# EAGLE design BigBus_XXL_Breed_Error (EAGLE 7.7.0)
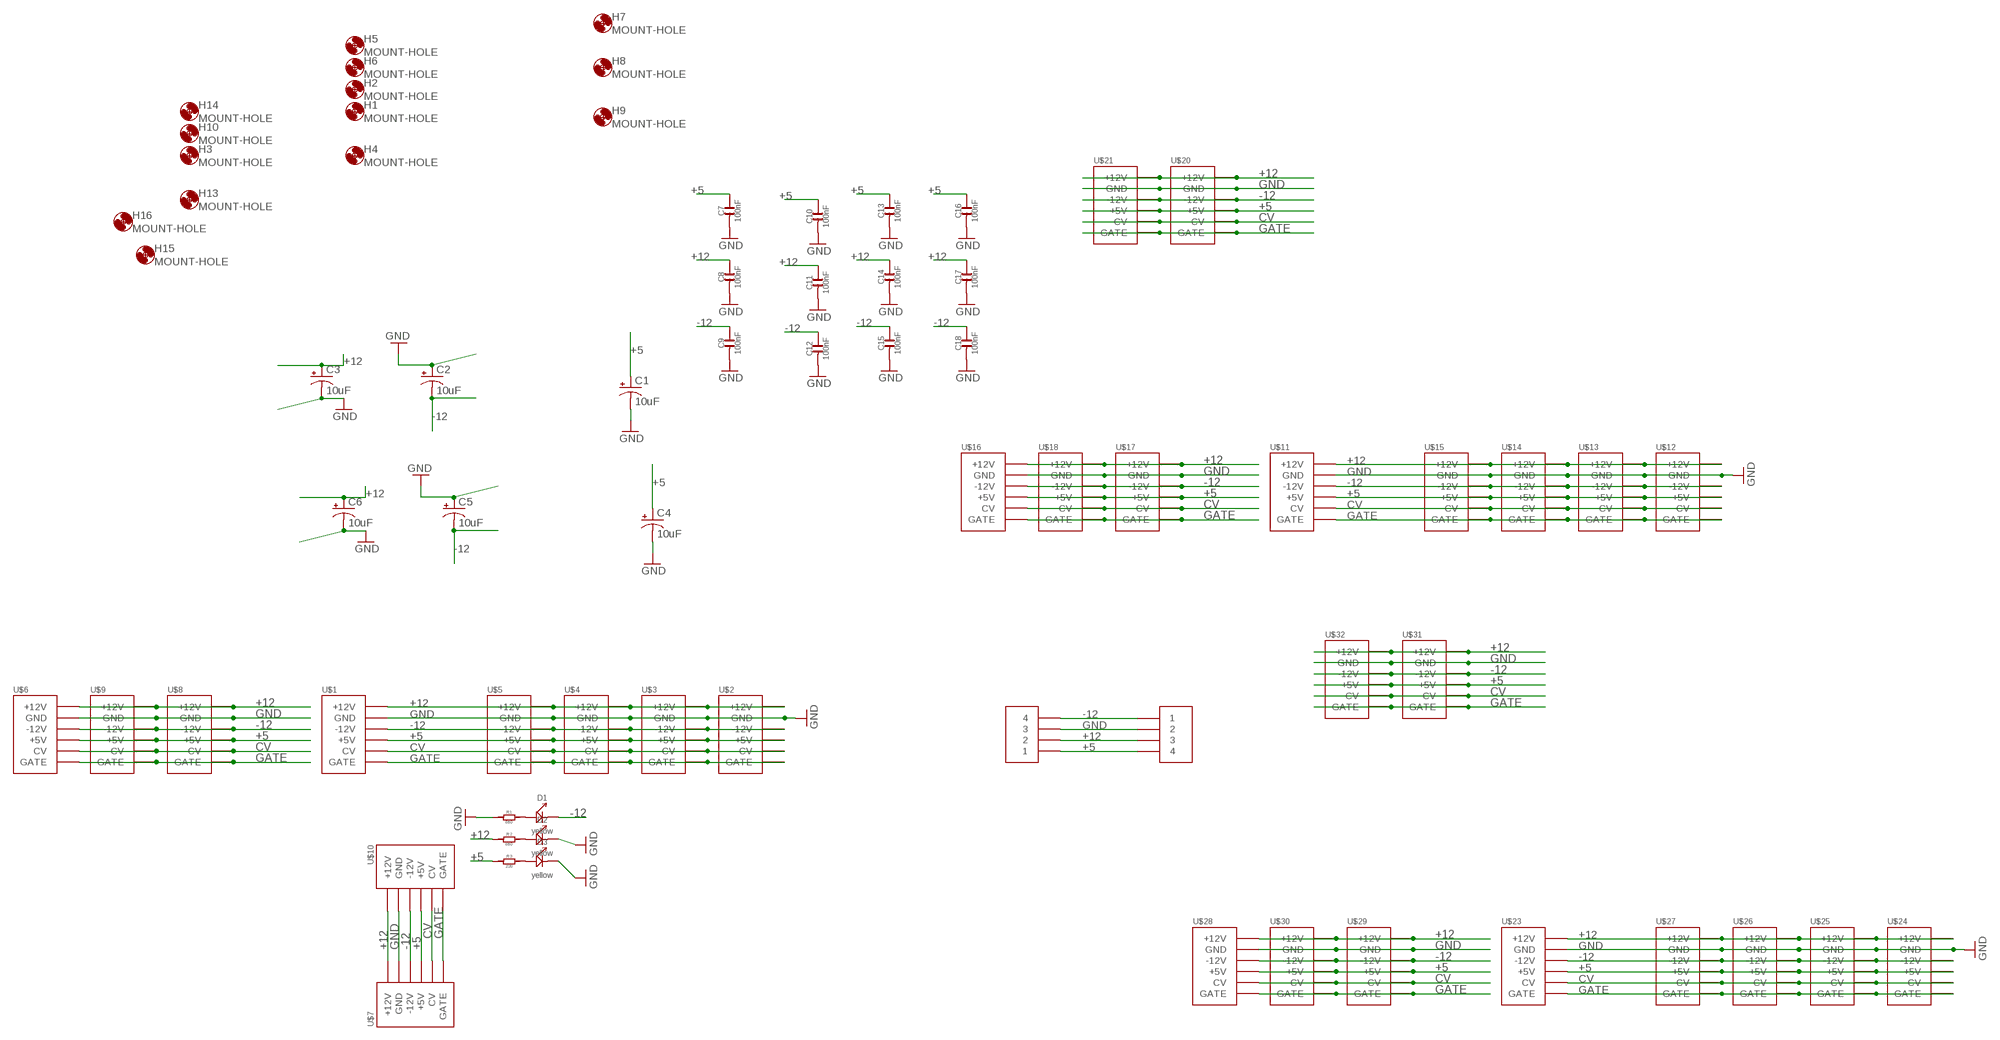
[diagram p0: schematic, sheet 1]

## Parts
C1  10uF  CAP_POLD  [PANASONIC_D]
C2  10uF  CAP_POLD  [PANASONIC_D]
C3  10uF  CAP_POLD  [PANASONIC_D]
C4  10uF  CAP_POLD  [PANASONIC_D]
C5  10uF  CAP_POLD  [PANASONIC_D]
C6  10uF  CAP_POLD  [PANASONIC_D]
C7  100nF  C-0603  [C0603]
C8  100nF  C-0603  [C0603]
C9  100nF  C-0603  [C0603]
C10  100nF  C-0603  [C0603]
C11  100nF  C-0603  [C0603]
C12  100nF  C-0603  [C0603]
C13  100nF  C-0603  [C0603]
C14  100nF  C-0603  [C0603]
C15  100nF  C-0603  [C0603]
C16  100nF  C-0603  [C0603]
C17  100nF  C-0603  [C0603]
C18  100nF  C-0603  [C0603]
D1  yellow  LED  [LED0603]
D2  yellow  LED  [LED0603]
D3  yellow  LED  [LED0603]
H1  MOUNT-HOLE  [3.2-NOMARKINGS-SMALLSAFEZONE]
H2  MOUNT-HOLE  [3.2-NOMARKINGS-SMALLSAFEZONE]
H3  MOUNT-HOLE  [3.2-NOMARKINGS-SMALLSAFEZONE]
H4  MOUNT-HOLE  [3.2-NOMARKINGS-SMALLSAFEZONE]
H5  MOUNT-HOLE  [3.2-NOMARKINGS-SMALLSAFEZONE]
H6  MOUNT-HOLE  [3.2-NOMARKINGS-SMALLSAFEZONE]
H7  MOUNT-HOLE  [3.2-NOMARKINGS-SMALLSAFEZONE]
H8  MOUNT-HOLE  [3.2-NOMARKINGS-SMALLSAFEZONE]
H9  MOUNT-HOLE  [3.2-NOMARKINGS-SMALLSAFEZONE]
H10  MOUNT-HOLE  [3.2-NOMARKINGS-SMALLSAFEZONE]
H13  MOUNT-HOLE  [3.2-NOMARKINGS-SMALLSAFEZONE]
H14  MOUNT-HOLE  [3.2-NOMARKINGS-SMALLSAFEZONE]
H15  MOUNT-HOLE  [3.2-NOMARKINGS-SMALLSAFEZONE]
H16  MOUNT-HOLE  [3.2-NOMARKINGS-SMALLSAFEZONE]
R1  680  R-0603  [R0603]
R2  680  R-0603  [R0603]
R3  220  R-0603  [R0603]
U$1  POWER_SHROUDED_NOTEXT  [POWER_16_SHROUDED_NOTEXT]
U$2  POWER_SHROUDED_NOTEXT  [POWER_16_SHROUDED_NOTEXT]
U$3  POWER_SHROUDED_NOTEXT  [POWER_16_SHROUDED_NOTEXT]
U$4  POWER_SHROUDED_NOTEXT  [POWER_16_SHROUDED_NOTEXT]
U$5  POWER_SHROUDED_NOTEXT  [POWER_16_SHROUDED_NOTEXT]
U$6  POWER_SHROUDED_NOTEXT  [POWER_16_SHROUDED_NOTEXT]
U$7  POWER_SHROUDED_NOTEXT  [POWER_16_SHROUDED_NOTEXT]
U$8  POWER_SHROUDED_NOTEXT  [POWER_16_SHROUDED_NOTEXT]
U$9  POWER_SHROUDED_NOTEXT  [POWER_16_SHROUDED_NOTEXT]
U$10  POWER_SHROUDED_NOTEXT  [POWER_16_SHROUDED_NOTEXT]
U$11  POWER_SHROUDED_NOTEXT  [POWER_16_SHROUDED_NOTEXT]
U$12  POWER_SHROUDED_NOTEXT  [POWER_16_SHROUDED_NOTEXT]
U$13  POWER_SHROUDED_NOTEXT  [POWER_16_SHROUDED_NOTEXT]
U$14  POWER_SHROUDED_NOTEXT  [POWER_16_SHROUDED_NOTEXT]
U$15  POWER_SHROUDED_NOTEXT  [POWER_16_SHROUDED_NOTEXT]
U$16  POWER_SHROUDED_NOTEXT  [POWER_16_SHROUDED_NOTEXT]
U$17  POWER_SHROUDED_NOTEXT  [POWER_16_SHROUDED_NOTEXT]
U$18  POWER_SHROUDED_NOTEXT  [POWER_16_SHROUDED_NOTEXT]
U$19  4PIN5MM  [4PIN5MM]
U$20  POWER_SHROUDED_NOTEXT  [POWER_16_SHROUDED_NOTEXT]
U$21  POWER_SHROUDED_NOTEXT  [POWER_16_SHROUDED_NOTEXT]
U$22  4PIN5MM  [4PIN5MM]
U$23  POWER_SHROUDED_NOTEXT  [POWER_16_SHROUDED_NOTEXT]
U$24  POWER_SHROUDED_NOTEXT  [POWER_16_SHROUDED_NOTEXT]
U$25  POWER_SHROUDED_NOTEXT  [POWER_16_SHROUDED_NOTEXT]
U$26  POWER_SHROUDED_NOTEXT  [POWER_16_SHROUDED_NOTEXT]
U$27  POWER_SHROUDED_NOTEXT  [POWER_16_SHROUDED_NOTEXT]
U$28  POWER_SHROUDED_NOTEXT  [POWER_16_SHROUDED_NOTEXT]
U$29  POWER_SHROUDED_NOTEXT  [POWER_16_SHROUDED_NOTEXT]
U$30  POWER_SHROUDED_NOTEXT  [POWER_16_SHROUDED_NOTEXT]
U$31  POWER_SHROUDED_NOTEXT  [POWER_16_SHROUDED_NOTEXT]
U$32  POWER_SHROUDED_NOTEXT  [POWER_16_SHROUDED_NOTEXT]

## Nets
+5: C1.+ C4.+ C7.2 C10.2 C13.2 C16.2 R3.1 U$1.11(+5V) U$1.12(+5V) U$2.11(+5V) U$2.12(+5V) U$3.11(+5V) U$3.12(+5V) U$4.11(+5V) U$4.12(+5V) U$5.11(+5V) U$5.12(+5V) U$6.11(+5V) U$6.12(+5V) U$7.11(+5V) U$7.12(+5V) U$8.11(+5V) U$8.12(+5V) U$9.11(+5V) U$9.12(+5V) U$10.11(+5V) U$10.12(+5V) U$11.11(+5V) U$11.12(+5V) U$12.11(+5V) U$12.12(+5V) U$13.11(+5V) U$13.12(+5V) U$14.11(+5V) U$14.12(+5V) U$15.11(+5V) U$15.12(+5V) U$16.11(+5V) U$16.12(+5V) U$17.11(+5V) U$17.12(+5V) U$18.11(+5V) U$18.12(+5V) U$19.4 U$20.11(+5V) U$20.12(+5V) U$21.11(+5V) U$21.12(+5V) U$22.1 U$23.11(+5V) U$23.12(+5V) U$24.11(+5V) U$24.12(+5V) U$25.11(+5V) U$25.12(+5V) U$26.11(+5V) U$26.12(+5V) U$27.11(+5V) U$27.12(+5V) U$28.11(+5V) U$28.12(+5V) U$29.11(+5V) U$29.12(+5V) U$30.11(+5V) U$30.12(+5V) U$31.11(+5V) U$31.12(+5V) U$32.11(+5V) U$32.12(+5V)
+12: C3.+ C6.+ C8.2 C11.2 C14.2 C17.2 R2.1 U$1.9(+12V) U$1.10(+12V) U$2.9(+12V) U$2.10(+12V) U$3.9(+12V) U$3.10(+12V) U$4.9(+12V) U$4.10(+12V) U$5.9(+12V) U$5.10(+12V) U$6.9(+12V) U$6.10(+12V) U$7.9(+12V) U$7.10(+12V) U$8.9(+12V) U$8.10(+12V) U$9.9(+12V) U$9.10(+12V) U$10.9(+12V) U$10.10(+12V) U$11.9(+12V) U$11.10(+12V) U$12.9(+12V) U$12.10(+12V) U$13.9(+12V) U$13.10(+12V) U$14.9(+12V) U$14.10(+12V) U$15.9(+12V) U$15.10(+12V) U$16.9(+12V) U$16.10(+12V) U$17.9(+12V) U$17.10(+12V) U$18.9(+12V) U$18.10(+12V) U$19.3 U$20.9(+12V) U$20.10(+12V) U$21.9(+12V) U$21.10(+12V) U$22.2 U$23.9(+12V) U$23.10(+12V) U$24.9(+12V) U$24.10(+12V) U$25.9(+12V) U$25.10(+12V) U$26.9(+12V) U$26.10(+12V) U$27.9(+12V) U$27.10(+12V) U$28.9(+12V) U$28.10(+12V) U$29.9(+12V) U$29.10(+12V) U$30.9(+12V) U$30.10(+12V) U$31.9(+12V) U$31.10(+12V) U$32.9(+12V) U$32.10(+12V)
-12: C2.- C5.- C9.2 C12.2 C15.2 C18.2 D1.- U$1.1(-12V) U$1.2(-12V) U$2.1(-12V) U$2.2(-12V) U$3.1(-12V) U$3.2(-12V) U$4.1(-12V) U$4.2(-12V) U$5.1(-12V) U$5.2(-12V) U$6.1(-12V) U$6.2(-12V) U$7.1(-12V) U$7.2(-12V) U$8.1(-12V) U$8.2(-12V) U$9.1(-12V) U$9.2(-12V) U$10.1(-12V) U$10.2(-12V) U$11.1(-12V) U$11.2(-12V) U$12.1(-12V) U$12.2(-12V) U$13.1(-12V) U$13.2(-12V) U$14.1(-12V) U$14.2(-12V) U$15.1(-12V) U$15.2(-12V) U$16.1(-12V) U$16.2(-12V) U$17.1(-12V) U$17.2(-12V) U$18.1(-12V) U$18.2(-12V) U$19.1 U$20.1(-12V) U$20.2(-12V) U$21.1(-12V) U$21.2(-12V) U$22.4 U$23.1(-12V) U$23.2(-12V) U$24.1(-12V) U$24.2(-12V) U$25.1(-12V) U$25.2(-12V) U$26.1(-12V) U$26.2(-12V) U$27.1(-12V) U$27.2(-12V) U$28.1(-12V) U$28.2(-12V) U$29.1(-12V) U$29.2(-12V) U$30.1(-12V) U$30.2(-12V) U$31.1(-12V) U$31.2(-12V) U$32.1(-12V) U$32.2(-12V)
CV: U$1.13(CV) U$1.14(CV) U$2.13(CV) U$2.14(CV) U$3.13(CV) U$3.14(CV) U$4.13(CV) U$4.14(CV) U$5.13(CV) U$5.14(CV) U$6.13(CV) U$6.14(CV) U$7.13(CV) U$7.14(CV) U$8.13(CV) U$8.14(CV) U$9.13(CV) U$9.14(CV) U$10.13(CV) U$10.14(CV) U$11.13(CV) U$11.14(CV) U$12.13(CV) U$12.14(CV) U$13.13(CV) U$13.14(CV) U$14.13(CV) U$14.14(CV) U$15.13(CV) U$15.14(CV) U$16.13(CV) U$16.14(CV) U$17.13(CV) U$17.14(CV) U$18.13(CV) U$18.14(CV) U$20.13(CV) U$20.14(CV) U$21.13(CV) U$21.14(CV) U$23.13(CV) U$23.14(CV) U$24.13(CV) U$24.14(CV) U$25.13(CV) U$25.14(CV) U$26.13(CV) U$26.14(CV) U$27.13(CV) U$27.14(CV) U$28.13(CV) U$28.14(CV) U$29.13(CV) U$29.14(CV) U$30.13(CV) U$30.14(CV) U$31.13(CV) U$31.14(CV) U$32.13(CV) U$32.14(CV)
GATE: U$1.15(GATE) U$1.16(GATE) U$2.15(GATE) U$2.16(GATE) U$3.15(GATE) U$3.16(GATE) U$4.15(GATE) U$4.16(GATE) U$5.15(GATE) U$5.16(GATE) U$6.15(GATE) U$6.16(GATE) U$7.15(GATE) U$7.16(GATE) U$8.15(GATE) U$8.16(GATE) U$9.15(GATE) U$9.16(GATE) U$10.15(GATE) U$10.16(GATE) U$11.15(GATE) U$11.16(GATE) U$12.15(GATE) U$12.16(GATE) U$13.15(GATE) U$13.16(GATE) U$14.15(GATE) U$14.16(GATE) U$15.15(GATE) U$15.16(GATE) U$16.15(GATE) U$16.16(GATE) U$17.15(GATE) U$17.16(GATE) U$18.15(GATE) U$18.16(GATE) U$20.15(GATE) U$20.16(GATE) U$21.15(GATE) U$21.16(GATE) U$23.15(GATE) U$23.16(GATE) U$24.15(GATE) U$24.16(GATE) U$25.15(GATE) U$25.16(GATE) U$26.15(GATE) U$26.16(GATE) U$27.15(GATE) U$27.16(GATE) U$28.15(GATE) U$28.16(GATE) U$29.15(GATE) U$29.16(GATE) U$30.15(GATE) U$30.16(GATE) U$31.15(GATE) U$31.16(GATE) U$32.15(GATE) U$32.16(GATE)
GND: C1.- C2.+ C3.- C4.- C5.+ C6.- C7.1 C8.1 C9.1 C10.1 C11.1 C12.1 C13.1 C14.1 C15.1 C16.1 C17.1 C18.1 D2.- D3.- R1.1 U$1.3(GND) U$1.4(GND) U$1.5(GND) U$1.6(GND) U$1.7(GND) U$1.8(GND) U$2.3(GND) U$2.4(GND) U$2.5(GND) U$2.6(GND) U$2.7(GND) U$2.8(GND) U$3.3(GND) U$3.4(GND) U$3.5(GND) U$3.6(GND) U$3.7(GND) U$3.8(GND) U$4.3(GND) U$4.4(GND) U$4.5(GND) U$4.6(GND) U$4.7(GND) U$4.8(GND) U$5.3(GND) U$5.4(GND) U$5.5(GND) U$5.6(GND) U$5.7(GND) U$5.8(GND) U$6.3(GND) U$6.4(GND) U$6.5(GND) U$6.6(GND) U$6.7(GND) U$6.8(GND) U$7.3(GND) U$7.4(GND) U$7.5(GND) U$7.6(GND) U$7.7(GND) U$7.8(GND) U$8.3(GND) U$8.4(GND) U$8.5(GND) U$8.6(GND) U$8.7(GND) U$8.8(GND) U$9.3(GND) U$9.4(GND) U$9.5(GND) U$9.6(GND) U$9.7(GND) U$9.8(GND) U$10.3(GND) U$10.4(GND) U$10.5(GND) U$10.6(GND) U$10.7(GND) U$10.8(GND) U$11.3(GND) U$11.4(GND) U$11.5(GND) U$11.6(GND) U$11.7(GND) U$11.8(GND) U$12.3(GND) U$12.4(GND) U$12.5(GND) U$12.6(GND) U$12.7(GND) U$12.8(GND) U$13.3(GND) U$13.4(GND) U$13.5(GND) U$13.6(GND) U$13.7(GND) U$13.8(GND) U$14.3(GND) U$14.4(GND) U$14.5(GND) U$14.6(GND) U$14.7(GND) U$14.8(GND) U$15.3(GND) U$15.4(GND) U$15.5(GND) U$15.6(GND) U$15.7(GND) U$15.8(GND) U$16.3(GND) U$16.4(GND) U$16.5(GND) U$16.6(GND) U$16.7(GND) U$16.8(GND) U$17.3(GND) U$17.4(GND) U$17.5(GND) U$17.6(GND) U$17.7(GND) U$17.8(GND) U$18.3(GND) U$18.4(GND) U$18.5(GND) U$18.6(GND) U$18.7(GND) U$18.8(GND) U$19.2 U$20.3(GND) U$20.4(GND) U$20.5(GND) U$20.6(GND) U$20.7(GND) U$20.8(GND) U$21.3(GND) U$21.4(GND) U$21.5(GND) U$21.6(GND) U$21.7(GND) U$21.8(GND) U$22.3 U$23.3(GND) U$23.4(GND) U$23.5(GND) U$23.6(GND) U$23.7(GND) U$23.8(GND) U$24.3(GND) U$24.4(GND) U$24.5(GND) U$24.6(GND) U$24.7(GND) U$24.8(GND) U$25.3(GND) U$25.4(GND) U$25.5(GND) U$25.6(GND) U$25.7(GND) U$25.8(GND) U$26.3(GND) U$26.4(GND) U$26.5(GND) U$26.6(GND) U$26.7(GND) U$26.8(GND) U$27.3(GND) U$27.4(GND) U$27.5(GND) U$27.6(GND) U$27.7(GND) U$27.8(GND) U$28.3(GND) U$28.4(GND) U$28.5(GND) U$28.6(GND) U$28.7(GND) U$28.8(GND) U$29.3(GND) U$29.4(GND) U$29.5(GND) U$29.6(GND) U$29.7(GND) U$29.8(GND) U$30.3(GND) U$30.4(GND) U$30.5(GND) U$30.6(GND) U$30.7(GND) U$30.8(GND) U$31.3(GND) U$31.4(GND) U$31.5(GND) U$31.6(GND) U$31.7(GND) U$31.8(GND) U$32.3(GND) U$32.4(GND) U$32.5(GND) U$32.6(GND) U$32.7(GND) U$32.8(GND)
N$1: D1.+ R1.2
N$2: D2.+ R2.2
N$3: D3.+ R3.2

## Library data of the parts
C1-C6 = SparkFun-Capacitors:CAP_POL: Capacitor Polarized These are standard SMD and PTH capacitors. Normally 10uF, 47uF, and 100uF in electrolytic and tantalum varieties. Always verify the external diameter of the through hole cap, it varies with capacity, voltage, and manufacturer. The EIA devices should be standard.
C7-C18 = OPL:C*
D1-D3 = OPL:LED*: LED
H1-H10 H13-H16 = zephod-components:MOUNT-HOLE: MOUNTING HOLE with drill center marker
R1-R3 = OPL:R*
U$1-U$18 U$20 U$21 U$23-U$32 = EurorackModularParts:POWER
U$19 U$22 = EurorackModularParts:4PIN5MM

## Net classes
0 default: width 0.5 mm, clearance 0.381 mm
1 Powertrace: width 1.87 mm
2 smalltrace: width 0.254 mm

## Board
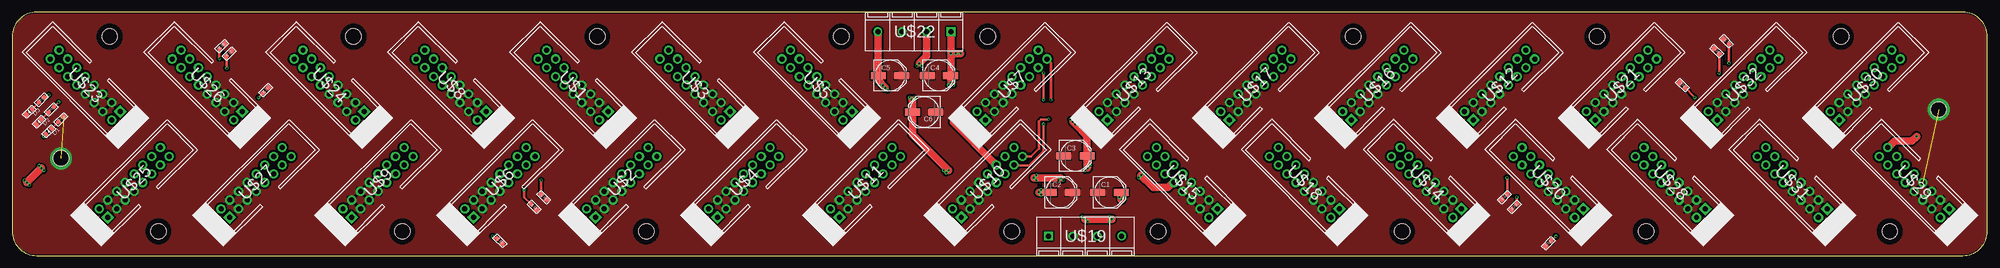
[diagram p1: board, top side]
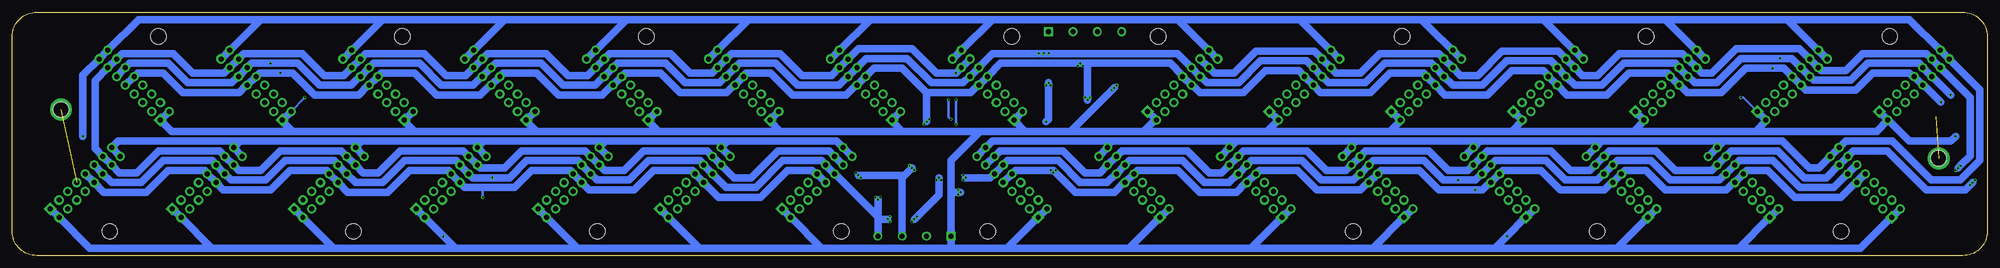
[diagram p2: board, bottom side, seen from below]

Size 405 x 50 mm. Coordinates in mm from the lower left corner, seen from the top.
Outline: 0,45 0,5 arc90 5,0 400,0 arc90 405,5 405,45 arc90 400,50 5,50 arc90 0,45
Copper layers (1*16): Top 0.035mm / dielectric 1.5mm / Bottom 0.035mm
Design rules "dirt_cheap_dirty_boards.v1": minimum track width 5mil, minimum drill 12mil, track to track 5mil, track to pad 5mil, pad to pad 5mil, via to via 5mil, smd to smd 0mil, copper to edge 10mil, drill to drill 10mil, minimum pad ring 10mil, minimum via ring 6mil, stop-mask expansion 2mil, vias tented up to drill 25mil, thermal gap 10mil
Holes 3.2 mm at 10,20 395,30

### Footprints (pad centres in the part's own frame; a part is rotated, then mirrored left to right if it is on the bottom)
PANASONIC_D = smd 3 x 1.4: + 2.4,0; - -2.4,0
C0603 = smd 0.889 x 0.889: 1 -0.762,0; 2 0.762,0
LED0603 = smd 0.762 x 0.889: + -0.762,0; - 0.762,0
3.2-NOMARKINGS-SMALLSAFEZONE = hole 3.2: 0,0
R0603 = smd 0.889 x 0.889: 1 -0.762,0; 2 0.762,0
POWER_16_SHROUDED_NOTEXT = drill 1.016 pad 1.88 square: 1 -8.89,-1.27 | drill 1.016 pad 1.88: 2 -8.89,1.27; 3 -6.35,-1.27; 4 -6.35,1.27; 5 -3.81,-1.27; 6 -3.81,1.27; 7 -1.27,-1.27; 8 -1.27,1.27; 9 1.27,-1.27; 10 1.27,1.27; 11 3.81,-1.27; 12 3.81,1.27; 13 6.35,-1.27; 14 6.35,1.27; 15 8.89,-1.27; 16 8.89,1.27
4PIN5MM = drill 1.016 pad 1.778 square: 1 -7.5,0 | drill 1.016 pad 1.778: 2 -2.5,0; 3 2.5,0; 4 7.5,0

### Placement (x,y rotation side)
C1  225,13 0 top
C2  215,13 0 top
C3  218,20.5 0 top
C4  190,37 0 top
C5  180,37 0 top
C6  187,29.5 180 top
C7  351.5,44 315 top
C8  349.5,42 315 top
C9  342.5,35 315 top
C10  109,12 135 top
C11  107,10 135 top
C12  315,2.5 45 top
C13  306,12 45 top
C14  308,10 45 top
C15  52,34 225 top
C16  43,43 225 top
C17  44.5,41.5 225 top
C18  100,3 135 top
D1  7.5,25.5 225 top
D2  5.5,27.5 225 top
D3  3.5,29.5 225 top
H1  30,5 0 top
H2  285,5 0 top
H3  70,45 0 top
H4  275,45 0 top
H5  170,45 0 top
H6  205,5 0 top
H7  20,45 0 top
H8  120,45 0 top
H9  385,5 0 top
H10  80,5 0 top
H11  MOUNT-HOLE  [3.2-NOMARKINGS-SMALLSAFEZONE]  200,45 0 top
H12  MOUNT-HOLE  [3.2-NOMARKINGS-SMALLSAFEZONE]  235,5 0 top
H13  130,5 0 top
H14  335,5 0 top
H15  325,45 0 top
H16  375,45 0 top
R1  10,28 225 top
R2  8,30 225 top
R3  6,32 225 top
U$1  115,35 135 top
U$2  125,15 45 top
U$3  140,35 135 top
U$4  150,15 45 top
U$5  165,35 135 top
U$6  100,15 45 top
U$7  205,35 45 top
U$8  90,35 135 top
U$9  75,15 45 top
U$10  200,15 45 top
U$11  175,15 45 top
U$12  305,35 45 top
U$13  230,35 45 top
U$14  290,15 135 top
U$15  240,15 135 top
U$16  280,35 45 top
U$17  255,35 45 top
U$18  265,15 135 top
U$19  220,4 0 top
U$20  315,15 135 top
U$21  330,35 45 top
U$22  185,46 180 top
U$23  15,35 135 top
U$24  65,35 135 top
U$25  25,15 45 top
U$26  40,35 135 top
U$27  50,15 45 top
U$28  340,15 135 top
U$29  390,15 135 top
U$30  380,35 45 top
U$31  365,15 135 top
U$32  355,35 45 top

### Tracks (layer width: path | path; a pad name or v marks a point on that pad's centre or on a via)
+5  (via drill 0.3)
  Top 0.5: C10.2 108.46,15.46 v108.5,15.5 | R3.1 7.04,32.54 v7.5,33 | C16.2 42.46,40.54 v42.5,40.5 | C13.2 306.54,15.96 v306.5,16 | C7.2 352.04,39.54 v352,39.5 | 227.4,11.6 v227,12
  Top 1.5: v192.5,41.5 192.5,37.1 | 192.5,37.1 C4.+ | U$22.1 v192.5,41.5 | v192.5,41.5 v194.5,41.5 | C1.+ 227.4,11.6 v227.5,11.5 | v193,27.5 193,27.39 201.36,19.03 201.47,19.03 202,18.5 201.89,18.5 U$10.12 | v192.5,35.5 192.5,37.1 | v225.5,7.5 v220,7.5 | v215,16 v209.5,16
  Bottom 0.5: v192,35 v192.5,35.5 v193,35 | v210,16.5 v209.5,16 v210,15.5 | v215.5,15.5 v215,16 v214.5,15.5 | v220,7.5 v220.5,7 | v225.5,7.5 v225,7 v225,8 | v228,12 v227.5,11.5
  Bottom 1.5: U$25.11 U$25.12 26.91,18.59 31.5,14 38.5,14 44,19.5 50.89,19.5 U$27.12 U$27.11 53.7,16.8 55,15.5 65,15.5 69,19.5 75.89,19.5 U$9.12 U$9.11 78.7,16.8 80,15.5 86.5,15.5 90.5,19.5 100.89,19.5 U$6.12 U$6.11 103.7,16.8 105,15.5 v108.5,15.5 111.5,15.5 115.5,19.5 125.89,19.5 U$2.12 U$2.11 128.7,16.8 130,15.5 136.5,15.5 140.5,19.5 150.89,19.5 U$4.12 U$4.11 153.7,16.8 155.5,15 160.5,15 165,19.5 175.89,19.5 U$11.12 U$11.11 178.7,16.8 180.5,15 186,15 190.5,19.5 200.89,19.5 U$10.12 202.94,17.44 | 202.94,17.44 U$10.11 | U$17.12 U$17.11 258.7,36.8 260,35.5 267,35.5 271,39.5 280.89,39.5 U$16.12 U$16.11 283.7,36.8 285.5,35 292,35 296.5,39.5 305.89,39.5 U$12.12 U$12.11 308.7,36.8 310.5,35 317,35 321.5,39.5 330.89,39.5 U$21.12 U$21.11 333.7,36.8 335.5,35 342,35 346.5,39.5 v352,39.5 355.89,39.5 U$32.12 U$32.11 358.7,36.8 360,35.5 369,35.5 373,39.5 380.89,39.5 U$30.12 U$30.11 | U$29.11 U$29.12 384.61,15 378.5,15 374,19.5 364,19.5 363.2,18.7 U$31.11 U$31.12 360.11,15.5 353,15.5 349,19.5 339,19.5 338.2,18.7 U$28.11 U$28.12 334.61,15 329,15 324.5,19.5 314,19.5 313.2,18.7 U$20.11 U$20.12 310.61,16 v306.5,16 303,16 299.5,19.5 289,19.5 288.2,18.7 U$14.11 U$14.12 285.11,15.5 278.5,15.5 274.5,19.5 264,19.5 263.2,18.7 U$18.11 U$18.12 258.61,14 252.5,14 247,19.5 239,19.5 238.2,18.7 U$15.11 U$15.12 236.3,16.8 227.5,8 | 256.39,39 U$17.12 | U$17.12 255.89,39.5 248.5,39.5 244,35 235.5,35 233.7,36.8 U$13.11 U$13.12 229.89,40.5 221.5,40.5 216.5,35.5 210,35.5 208.7,36.8 U$7.11 U$7.12 206.8,38.7 204,41.5 v194.5,41.5 v193.5,41.5 166.11,41.5 U$5.11 U$5.12 161.3,36.8 160,35.5 153.5,35.5 149,40 139.61,40 U$3.11 U$3.12 135.11,35.5 127.5,35.5 123.5,39.5 114,39.5 113.2,38.7 U$1.11 U$1.12 109.61,35 103.5,35 98.5,40 89.5,40 88.2,38.7 U$8.11 U$8.12 84.61,35 79,35 74.5,39.5 64,39.5 63.2,38.7 U$24.11 U$24.12 61.3,36.8 60,35.5 55.5,35.5 50.5,40.5 v42.5,40.5 40.11,40.5 U$26.11 U$26.12 35.61,36 28,36 24.5,39.5 14,39.5 13.2,38.7 U$23.11 U$23.12 11.3,36.8 v7.5,33
  Bottom 1.5: 227.5,8 227.5,7 | 227.5,7 U$19.4 | v227.5,11.5 227.5,8 | v193,27.5 192.5,28 v192.5,35.5 | 227.5,7 227,7.5 v225.5,7.5 | v220,7.5 v219.5,8 215,12.5 v215,16 | v209.5,16 204.5,16 203.06,17.44 202.94,17.44
+12  (via drill 0.3)
  Top 0.5: C11.2 105,12 v105,13.5 | v9.5,31.5 | v9.5,31.5 R2.1 | C17.2 43.96,38.54 v44,38.5 | C14.2 308.54,11.96 v308.5,12 | C8.2 350.04,37.54 v350,37.5 | v217,28 v217.5,27.5
  Top 1.5: U$22.2 187.5,41 v186,39.5 | v220.5,18 220.4,18.1 C3.+ 220.4,24.6 v218,27 v217.5,27.5 | v192,17.5 184.6,24.9 C6.+ 184.6,31.9 v184.5,32 | U$15.10 238,15 237,14 234,14 v231.5,16.5
  Bottom 0.5: 9.54,31.54 10.46,32.46 v9.5,31.5 | v308.5,12 308.5,14 | v184,32.5 184.5,32.5 v185,32.5 | v185.5,39 v186,39.5 v186.5,39 | v191,17.5 191.5,17.5 v191.5,17 | v220,17.5 v220.5,18 v221,18.5 | v232,17 v231.5,16.5 v231,16
  Bottom 1.5: U$9.10 | U$9.10 U$9.9 77,15 78.5,13.5 87.5,13.5 91.5,17.5 99.3,17.5 U$6.10 | U$6.10 | U$6.10 U$6.9 102,15 103.5,13.5 v105,13.5 112.5,13.5 116.5,17.5 124.3,17.5 U$2.10 | U$2.10 | U$2.10 U$2.9 127,15 128.5,13.5 137.5,13.5 141.5,17.5 149.3,17.5 U$4.10 | U$4.10 | U$4.10 U$4.9 152,15 154,13 161.5,13 166,17.5 174.3,17.5 U$11.10 U$11.9 177,15 179,13 187,13 191.5,17.5 v192,17.5 199.3,17.5 U$10.10 U$10.9 | U$25.10 | U$25.10 U$25.9 | U$27.10 | U$27.10 U$27.9 52,15 53.5,13.5 66,13.5 70,17.5 74.3,17.5 U$9.10 | U$14.10 | U$14.10 U$14.9 290,17 290.5,17.5 298.5,17.5 302,14 308.5,14 312.2,14 U$20.10 U$20.9 | U$18.10 | U$18.10 U$18.9 265,17 265.5,17.5 273.5,17.5 277.5,13.5 286.7,13.5 U$14.10 | U$15.10 | U$15.10 U$15.9 240.3,16.8 241,17.5 246,17.5 251.5,12 260.2,12 U$18.10 | U$20.9 | U$28.10 | U$28.10 U$28.9 340,17 340.5,17.5 348,17.5 352,13.5 361.7,13.5 U$31.10 | U$31.10 | U$31.10 U$31.9 365,17 365.5,17.5 373,17.5 377.5,13 386.2,13 U$29.10 | U$29.10 | U$29.10 U$29.9 | U$30.9 U$30.10 379.3,37.5 374,37.5 370,33.5 358.5,33.5 357,35 U$32.9 U$32.10 354.3,37.5 v350,37.5 347.5,37.5 343,33 334,33 332,35 U$21.9 U$21.10 329.3,37.5 322.5,37.5 318,33 309,33 307,35 U$12.9 U$12.10 304.3,37.5 297.5,37.5 293,33 284,33 282,35 U$16.9 U$16.10 279.3,37.5 272,37.5 268,33.5 258.5,33.5 257,35 U$17.9 U$17.10 254.8,37 254.8,37.2 254.5,37.5 249.5,37.5 245,33 234,33 232,35 U$13.9 U$13.10 228.3,38.5 222.5,38.5 217.5,33.5 | 217.5,33.5 208.5,33.5 207,35 U$7.9 U$7.10 202.3,39.5 v186,39.5 184,39.5 | U$25.10 25.2,16.8 30,12 39.5,12 45,17.5 49.3,17.5 U$27.10 | U$20.9 315,17 315.5,17.5 323.5,17.5 328,13 336.2,13 U$28.10
  Bottom 1.5: 184,39.5 167.5,39.5 165,37 U$5.9 U$5.10 163,35 161.5,33.5 152.5,33.5 148,38 141.2,38 U$3.9 U$3.10 136.7,33.5 126.5,33.5 122.5,37.5 115.5,37.5 115,37 U$1.9 U$1.10 111.2,33 102.5,33 97.5,38 91,38 90,37 U$8.9 U$8.10 86.2,33 78,33 73.5,37.5 65.5,37.5 65,37 U$24.9 U$24.10 63,35 61.5,33.5 54.5,33.5 49.5,38.5 v44,38.5 41.7,38.5 U$26.9 U$26.10 37.2,34 27,34 23.5,37.5 16,37.5 15.3,36.8 U$23.9 U$23.10 13,35 9.54,31.54 | U$19.3 222.5,16 222,16.5 | 222,16.5 v220.5,18 | v217.5,27.5 217.5,33.5 | v184.5,32 184.5,32.5 184.5,39 184,39.5 | v231.5,16.5 222,16.5
-12  (via drill 0.3)
  Top 0.5: D1.- | D1.- v6.5,24.5 | C15.2 | C15.2 v50.5,32.5 | C12.2 315.61,3.04 v316.54,3.96 | C9.2 | C9.2 v345,32.5 | C18.2 98.96,3.54 v98.5,4
  Top 1.5: U$22.4 177.5,37.1 C5.- 177.6,35.9 v179,34.5 | U$5.1 172.18,29.68 | C2.- v210.5,13
  Bottom 0.5: v50.5,32.5 50.07,32.5 U$26.1 | v345,32.5 345,32.43 U$32.2 | v179,34.5 v178.5,35 | v211,13.5 v210.5,13 v211,12.5
  Bottom 1.5: U$9.1 U$9.2 67.89,9.61 76,1.5 | U$6.2 U$6.1 94.68,7.82 v98.5,4 101,1.5 | U$8.1 U$8.2 95.39,27.61 97.5,25.5 | U$2.2 U$2.1 119.68,7.82 126,1.5 | U$4.2 U$4.1 144.68,7.82 151,1.5 | U$26.1 U$26.2 45.39,27.61 47.5,25.5 | U$24.1 U$24.2 70.18,27.82 72.5,25.5 | U$23.1 U$23.2 | U$25.2 U$25.1 19.68,7.82 26,1.5 51,1.5 | U$27.2 U$27.1 44.68,7.82 51,1.5 | U$11.2 U$11.1 169.68,7.82 176,1.5 | U$10.2 U$10.1 194.68,7.82 201,1.5 | U$1.1 U$1.2 120.39,27.61 122.5,25.5 | U$3.1 U$3.2 147.7,25.5 | U$5.1 U$5.2 | U$7.2 U$7.1 197.3,25.5 | U$13.2 U$13.1 224.61,27.61 222.5,25.5 | U$17.2 U$17.1 249.61,27.61 247.5,25.5 | U$16.2 U$16.1 274.61,27.61 272.5,25.5 | U$14.1 U$14.2 289.07,1.5 | U$18.1 U$18.2 264.07,1.5 | U$15.2 U$15.1 | U$20.1 U$20.2 v316.54,3.96 314.07,1.5 | U$12.2 U$12.1 299.61,27.61 297.5,25.5 | U$28.1 U$28.2 339.07,1.5 | U$32.2 U$32.1 349.61,27.61 347.5,25.5 | U$21.2 U$21.1 324.61,27.61 322.5,25.5 | U$31.1 U$31.2 364.07,1.5 | U$29.1 U$29.2 389.07,1.5 364.07,1.5 | U$30.2 U$30.1 372.3,25.5 347.5,25.5 | 51,1.5 76,1.5 | 76,1.5 101,1.5 | 101,1.5 126,1.5 | 126,1.5 151,1.5 | 151,1.5 176,1.5 | 176,1.5 201,1.5 | 201,1.5 212.5,1.5 | 212.5,1.5 U$19.1 212.5,13 | U$15.2 245.39,7.61 | 264.07,1.5 289.07,1.5 | 289.07,1.5 314.07,1.5 | 314.07,1.5 339.07,1.5 | 339.07,1.5 364.07,1.5 | U$5.2 170.32,27.82 | 188,25.5 173,25.5 | 173,25.5 147.7,25.5 | 147.7,25.5 122.5,25.5 | 122.5,25.5 97.5,25.5 | 97.5,25.5 72.5,25.5 | 72.5,25.5 47.5,25.5 | 47.5,25.5 22.7,25.5 U$23.2 | 188,25.5 197.3,25.5 | 197.3,25.5 206.5,25.5 | 206.5,25.5 222.5,25.5 | 222.5,25.5 247.5,25.5 | 247.5,25.5 272.5,25.5 | 272.5,25.5 297.5,25.5 | 297.5,25.5 322.5,25.5 | 322.5,25.5 347.5,25.5 | 212.5,13 212.5,19.5 206.5,25.5 | v210.5,13 212.5,13
  Bottom 1.5: 264.07,1.5 239,1.5 | 239,1.5 212.5,1.5 | U$23.2 20.32,27.82 16,23.5 7.5,23.5 v6.5,24.5 | U$15.2 245.32,7.82 239,1.5 | v179,34.5 v179.5,34 188,25.5 | U$5.2 170.68,27.82 173,25.5
CV  (via drill 0.3)
  Top 0.5: v211.5,37.5 v211.5,32 | v211.5,27 211.5,21.5 208.5,18.5 205.48,18.5 U$10.13
  Top 1.5: v3,15 v6,18
  Bottom 0.5: v2.5,15.5 v3,15 | v6,18 v6.5,17.5 | v211.5,32 v211.5,27
  Bottom 1.5: U$5.13 U$5.14 158.52,37.5 154.5,37.5 150,42 138,42 136.41,40.41 U$3.13 U$3.14 133.52,37.5 128.5,37.5 124.5,41.5 112.5,41.5 111.41,40.41 U$1.13 U$1.14 108.02,37 104.5,37 99.5,42 88,42 86.41,40.41 U$8.13 U$8.14 83.02,37 80,37 75.5,41.5 62.5,41.5 61.41,40.41 U$24.13 U$24.14 59.59,38.59 58.5,37.5 56.5,37.5 51.5,42.5 38.52,42.5 U$26.13 U$26.14 34.02,38 29,38 25.5,41.5 12.5,41.5 11.41,40.41 U$23.13 U$23.14 3.5,32.48 3.5,20.5 v5.5,18.5 v6,18 | U$7.14 U$7.13 210.41,38.59 v211.5,37.5 215.5,37.5 220.5,42.5 231.48,42.5 U$13.14 U$13.13 235.41,38.59 237,37 243,37 247.5,41.5 257.48,41.5 U$17.14 | U$17.14 U$17.13 260.41,38.59 261.5,37.5 266,37.5 270,41.5 282.48,41.5 U$16.14 U$16.13 285.41,38.59 287,37 291,37 295.5,41.5 307.48,41.5 U$12.14 U$12.13 310.41,38.59 312,37 316,37 320.5,41.5 332.48,41.5 U$21.14 U$21.13 335.41,38.59 337,37 341,37 345.5,41.5 357.48,41.5 U$32.14 U$32.13 360.41,38.59 361.5,37.5 368,37.5 372,41.5 382.48,41.5 U$30.14 U$30.13 388,35.98 388,22 386.41,20.41 U$29.13 U$29.14 383.02,17 379.5,17 375,21.5 362.5,21.5 361.41,20.41 U$31.13 U$31.14 358.52,17.5 354,17.5 350,21.5 337.5,21.5 336.41,20.41 U$28.13 U$28.14 333.02,17 330,17 325.5,21.5 312.5,21.5 311.41,20.41 U$20.13 U$20.14 309.02,18 304,18 300.5,21.5 287.5,21.5 286.41,20.41 U$14.13 U$14.14 283.52,17.5 279.5,17.5 275.5,21.5 262.5,21.5 261.41,20.41 U$18.13 U$18.14 257.02,16 253.5,16 248,21.5 237.5,21.5 236.41,20.41 U$15.13 U$15.14 | 257.98,41 U$17.14 | v3,15 v3.5,14.5 4.5,13.5 12.5,13.5 20.5,21.5 27.5,21.5 28.59,20.41 U$25.14 U$25.13 30.41,18.59 33,16 37.5,16 43,21.5 52.48,21.5 U$27.14 U$27.13 55.41,18.59 56.5,17.5 64,17.5 68,21.5 77.48,21.5 U$9.14 U$9.13 80.41,18.59 81.5,17.5 85.5,17.5 89.5,21.5 102.48,21.5 U$6.14 U$6.13 105.41,18.59 106.5,17.5 110.5,17.5 114.5,21.5 127.48,21.5 U$2.14 U$2.13 130.41,18.59 131.5,17.5 135.5,17.5 139.5,21.5 152.48,21.5 U$4.14 U$4.13 155.41,18.59 157,17 159.5,17 164,21.5 177.48,21.5 U$11.14 U$11.13 180.41,18.59 182,17 185,17 189.5,21.5 202.48,21.5 U$10.14 U$10.13 205.41,18.59
GATE  (via drill 0.3)
  Top 0.5: U$10.15 208.89,20.39 210.5,22 210.5,27.5 211,28 v212.5,28 | U$7.15 213,39.57 213,37.5 v213,32
  Top 1.5: U$29.15 384.68,22.18 386,23.5 389.5,23.5 v390.5,24.5
  Bottom 0.5: v212.5,28 213,28.5 v213,32
  Bottom 1.5: U$9.15 U$9.16 80.32,22.18 79,23.5 | U$8.15 U$8.16 82.89,40.39 91,48.5 | U$6.15 U$6.16 105.32,22.18 104,23.5 | U$2.15 U$2.16 130.39,22.61 129.5,23.5 | U$26.15 U$26.16 32.89,40.39 41,48.5 | U$24.15 U$24.16 57.89,40.39 66,48.5 | U$27.15 U$27.16 55.32,22.18 54,23.5 | U$11.15 U$11.16 180.39,22.61 179.5,23.5 | U$10.15 U$10.16 205.32,22.18 204,23.5 179.5,23.5 | U$1.15 U$1.16 107.89,40.39 116,48.5 | U$3.16 U$3.15 134.68,42.18 141,48.5 | U$5.16 U$5.15 159.68,42.18 166,48.5 | U$13.15 U$13.16 235.32,42.18 229,48.5 | U$17.15 U$17.16 260.32,42.18 254,48.5 | U$16.15 U$16.16 285.32,42.18 279,48.5 | U$18.16 U$18.15 258.3,23.5 | U$15.16 U$15.15 234.68,22.18 236,23.5 258.3,23.5 | U$20.16 U$20.15 308.3,23.5 | U$12.15 U$12.16 310.32,42.18 304,48.5 | U$28.16 U$28.15 333.3,23.5 | U$21.15 U$21.16 335.32,42.18 329,48.5 | U$32.16 U$32.15 362.11,40.39 354,48.5 | U$31.16 U$31.15 358.3,23.5 | U$29.16 U$29.15 383.3,23.5 358.3,23.5 | 41,48.5 16,48.5 9.68,42.18 U$23.15 U$23.16 1.5,34.07 1.5,19.5 5.5,15.5 11.5,15.5 19.5,23.5 29,23.5 30.32,22.18 U$25.16 U$25.15 34.57,18 36.5,18 42,23.5 54,23.5 | 41,48.5 66,48.5 | 66,48.5 91,48.5 | 91,48.5 116,48.5 | 116,48.5 141,48.5 | 141,48.5 166,48.5 | 166,48.5 204,48.5 | 212.39,40.39 U$7.15 U$7.16 210.32,42.18 204,48.5 | 229,48.5 254,48.5 | 254,48.5 279,48.5 | 279,48.5 304,48.5 | 304,48.5 329,48.5 | 329,48.5 354,48.5 | 354,48.5 379.07,48.5 U$30.16 U$30.15 390.5,37.07 v390.5,24.5 | U$4.15 U$4.16 155.32,22.18 154,23.5 | 179.5,23.5 154,23.5 | 154,23.5 129.5,23.5 | 129.5,23.5 104,23.5 | 104,23.5 79,23.5 | 79,23.5 54,23.5 | 282.82,20.32 U$14.16 U$14.15 283.3,23.5 | 258.3,23.5 283.3,23.5 | 283.3,23.5 308.3,23.5 | 308.3,23.5 333.3,23.5
  Bottom 1.5: 333.3,23.5 358.3,23.5 | 204,48.5 229,48.5
GND  (via drill 3.2 pad 4.5)  (2 unrouted)
  other vias: 10,20 395,30
  pour Top: -4.5,54.5 402.5,55 arc-90 413,48.5 410,-9.5 4,-5 arc-90 -8.5,2
N$1
  Top 0.5: R1.2 D1.+
N$2
  Top 0.5: R2.2 D2.+
N$3
  Top 0.5: R3.2 | R3.2 4.5,30.5 | 4.5,30.5 | 4.5,30.5 D3.+